# EAGLE design rxm (EAGLE 6.6.0)
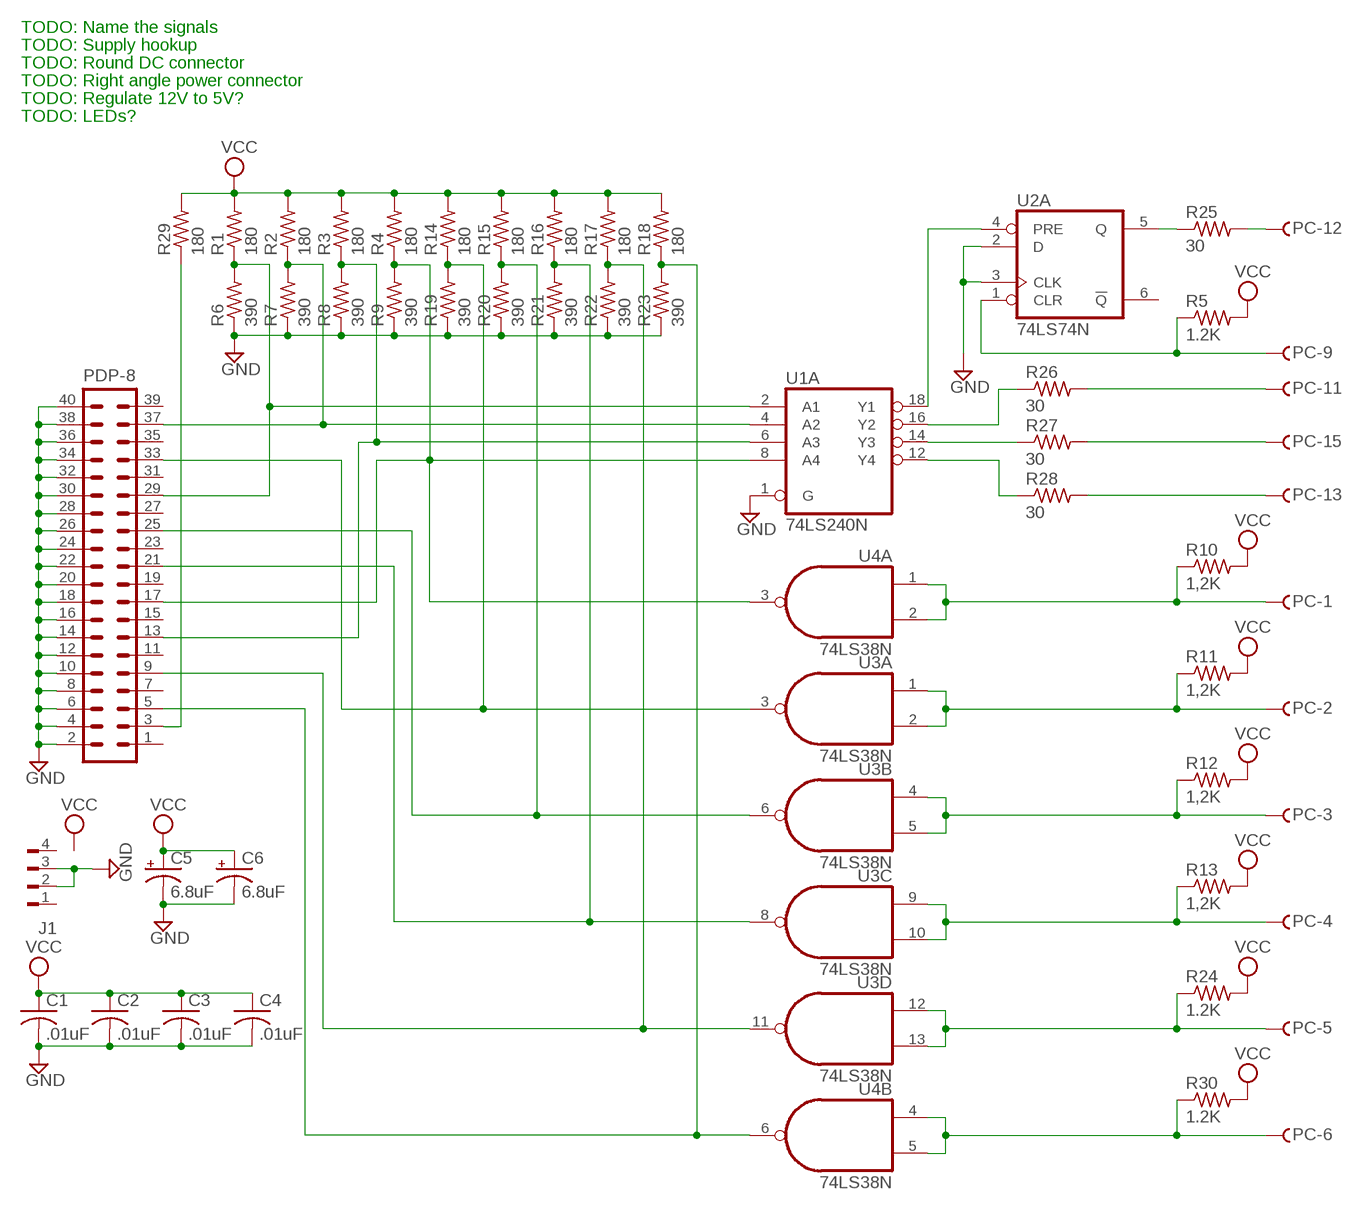
[diagram p0: schematic, sheet 1]

## Parts
C1  .01uF  C-US050-025X075  [C050-025X075]
C2  .01uF  C-US050-025X075  [C050-025X075]
C3  .01uF  C-US050-025X075  [C050-025X075]
C4  .01uF  C-US050-025X075  [C050-025X075]
C5  6.8uF  CPOL-USE2,5-6E  [E2,5-6E]
C6  6.8uF  CPOL-USE2,5-6E  [E2,5-6E]
J1  FLOPPY-4  [FLOPPY-4]
PC  F25HS  [F25H]
PDP-8  40H  [40H]
R1  180  R-US_0207/10  [0207/10]
R2  180  R-US_0207/10  [0207/10]
R3  180  R-US_0207/10  [0207/10]
R4  180  R-US_0207/10  [0207/10]
R5  1.2K  R-US_0207/10  [0207/10]
R6  390  R-US_0207/10  [0207/10]
R7  390  R-US_0207/10  [0207/10]
R8  390  R-US_0207/10  [0207/10]
R9  390  R-US_0207/10  [0207/10]
R10  1,2K  R-US_0207/10  [0207/10]
R11  1,2K  R-US_0207/10  [0207/10]
R12  1,2K  R-US_0207/10  [0207/10]
R13  1,2K  R-US_0207/10  [0207/10]
R14  180  R-US_0207/10  [0207/10]
R15  180  R-US_0207/10  [0207/10]
R16  180  R-US_0207/10  [0207/10]
R17  180  R-US_0207/10  [0207/10]
R18  180  R-US_0207/10  [0207/10]
R19  390  R-US_0207/10  [0207/10]
R20  390  R-US_0207/10  [0207/10]
R21  390  R-US_0207/10  [0207/10]
R22  390  R-US_0207/10  [0207/10]
R23  390  R-US_0207/10  [0207/10]
R24  1.2K  R-US_0207/10  [0207/10]
R25  30  R-US_0207/10  [0207/10]
R26  30  R-US_0207/10  [0207/10]
R27  30  R-US_0207/10  [0207/10]
R28  30  R-US_0207/10  [0207/10]
R29  180  R-US_0207/10  [0207/10]
R30  1.2K  R-US_0207/10  [0207/10]
U1  74LS240N  [DIL20]
U2  74LS74N  [DIL14]
U3  74LS38N  [DIL14]
U4  74LS38N  [DIL14]

## Nets
GND: C1.2 C2.2 C3.2 C4.2 C5.- C6.- J1.2 J1.3 PDP-8.2 PDP-8.4 PDP-8.6 PDP-8.8 PDP-8.10 PDP-8.12 PDP-8.14 PDP-8.16 PDP-8.18 PDP-8.20 PDP-8.22 PDP-8.24 PDP-8.26 PDP-8.28 PDP-8.30 PDP-8.32 PDP-8.34 PDP-8.36 PDP-8.38 PDP-8.40 R6.1 R7.1 R8.1 R9.1 R19.1 R20.1 R21.1 R22.1 R23.1 U1.1(A:G) U2.2(A:D) U2.3(A:CLK)
N$1: PDP-8.29 R1.1 R6.2 U1.2(A:A1)
N$2: PDP-8.37 R2.1 R7.2 U1.4(A:A2)
N$3: PDP-8.13 R3.1 R8.2 U1.6(A:A3)
N$4: PDP-8.17 R4.1 R9.2 U1.8(A:A4) U4.3(A:O)
N$6: PDP-8.33 R14.1 R19.2 U3.3(A:O)
N$7: PDP-8.25 R15.1 R20.2 U3.6(B:O)
N$8: PDP-8.21 R16.1 R21.2 U3.8(C:O)
N$9: PDP-8.9 R17.1 R22.2 U3.11(D:O)
N$10: PDP-8.5 R18.1 R23.2 U4.6(B:O)
N$11: PC.12 R25.2
N$12: PC.11 R26.2
N$13: PC.15 R27.2
N$14: PC.13 R28.2
N$15: PDP-8.3 R29.1
N$16: PC.1 R10.1 U4.1(A:I0) U4.2(A:I1)
N$17: PC.2 R11.1 U3.1(A:I0) U3.2(A:I1)
N$18: PC.3 R12.1 U3.4(B:I0) U3.5(B:I1)
N$19: PC.4 R13.1 U3.9(C:I0) U3.10(C:I1)
N$20: PC.6 R30.1 U4.4(B:I0) U4.5(B:I1)
N$21: PC.5 R24.1 U3.12(D:I0) U3.13(D:I1)
N$22: U1.18(A:Y1) U2.4(A:PRE)
N$23: PC.9 R5.1 U2.1(A:CLR)
N$24: R25.1 U2.5(A:Q)
N$25: R28.1 U1.12(A:Y4)
N$26: R27.1 U1.14(A:Y3)
N$27: R26.1 U1.16(A:Y2)
VCC: C1.1 C2.1 C3.1 C4.1 C5.+ C6.+ R1.2 R2.2 R3.2 R4.2 R5.2 R10.2 R11.2 R12.2 R13.2 R14.2 R15.2 R16.2 R17.2 R18.2 R24.2 R29.2 R30.2
Unconnected: J1.1 J1.4 PC.7 PC.8 PC.10 PC.14 PC.16 PC.17 PC.18 PC.19 PC.20 PC.21 PC.22 PC.23 PC.24 PC.25 PDP-8.1 PDP-8.7 PDP-8.11 PDP-8.15 PDP-8.19 PDP-8.23 PDP-8.27 PDP-8.31 PDP-8.35 PDP-8.39 U1.3(B:Y4) U1.5(B:Y3) U1.7(B:Y2) U1.9(B:Y1) U1.11(B:A1) U1.13(B:A2) U1.15(B:A3) U1.17(B:A4) U1.19(B:G) U2.6(A:!Q) U2.8(B:!Q) U2.9(B:Q) U2.10(B:PRE) U2.11(B:CLK) U2.12(B:D) U2.13(B:CLR) U4.8(C:O) U4.9(C:I0) U4.10(C:I1) U4.11(D:O) U4.12(D:I0) U4.13(D:I1)

## Notes on the sheet
- TODO: Name the signals
- TODO: Supply hookup
- TODO: Round DC connector
- TODO: Right angle power connector
- TODO: Regulate 12V to 5V?
- TODO: LEDs?

## Power pins joined to a net without a drawn wire
GND: U1.10(P:GND) U2.7(P:GND) U3.7(P:GND) U4.7(P:GND)
VCC: U1.20(P:VCC) U2.14(P:VCC) U3.14(P:VCC) U4.14(P:VCC)

## Library data of the parts
C1-C4 = rcl:C-US: CAPACITOR, American symbol
C5 C6 = rcl:CPOL-US: POLARIZED CAPACITOR, American symbol
J1 = con-amp:FLOPPY-4: MATE N-LOCK Floppy / HDD conector Distributor: Bürklin 71F970
PC = con-subd:F25?S: SUB-D; OC_FARNELL: unknown; OC_NEWARK: unknown
PDP-8 = con-harting-h:40H: CONNECTOR; OC_FARNELL: unknown; OC_NEWARK: unknown
R1-R30 = rcl:R-US_: RESISTOR, American symbol
U1 = 74xx-us:74*240: Octal BUFFER and LINE DRIVER, 3-state
U2 = 74xx-us:74*74: Dual D type positive edge triggered FLIP FLOP, preset and clear
U3 U4 = dec-con:74*38: Quad 2-input NAND gate, open collector output

## Board
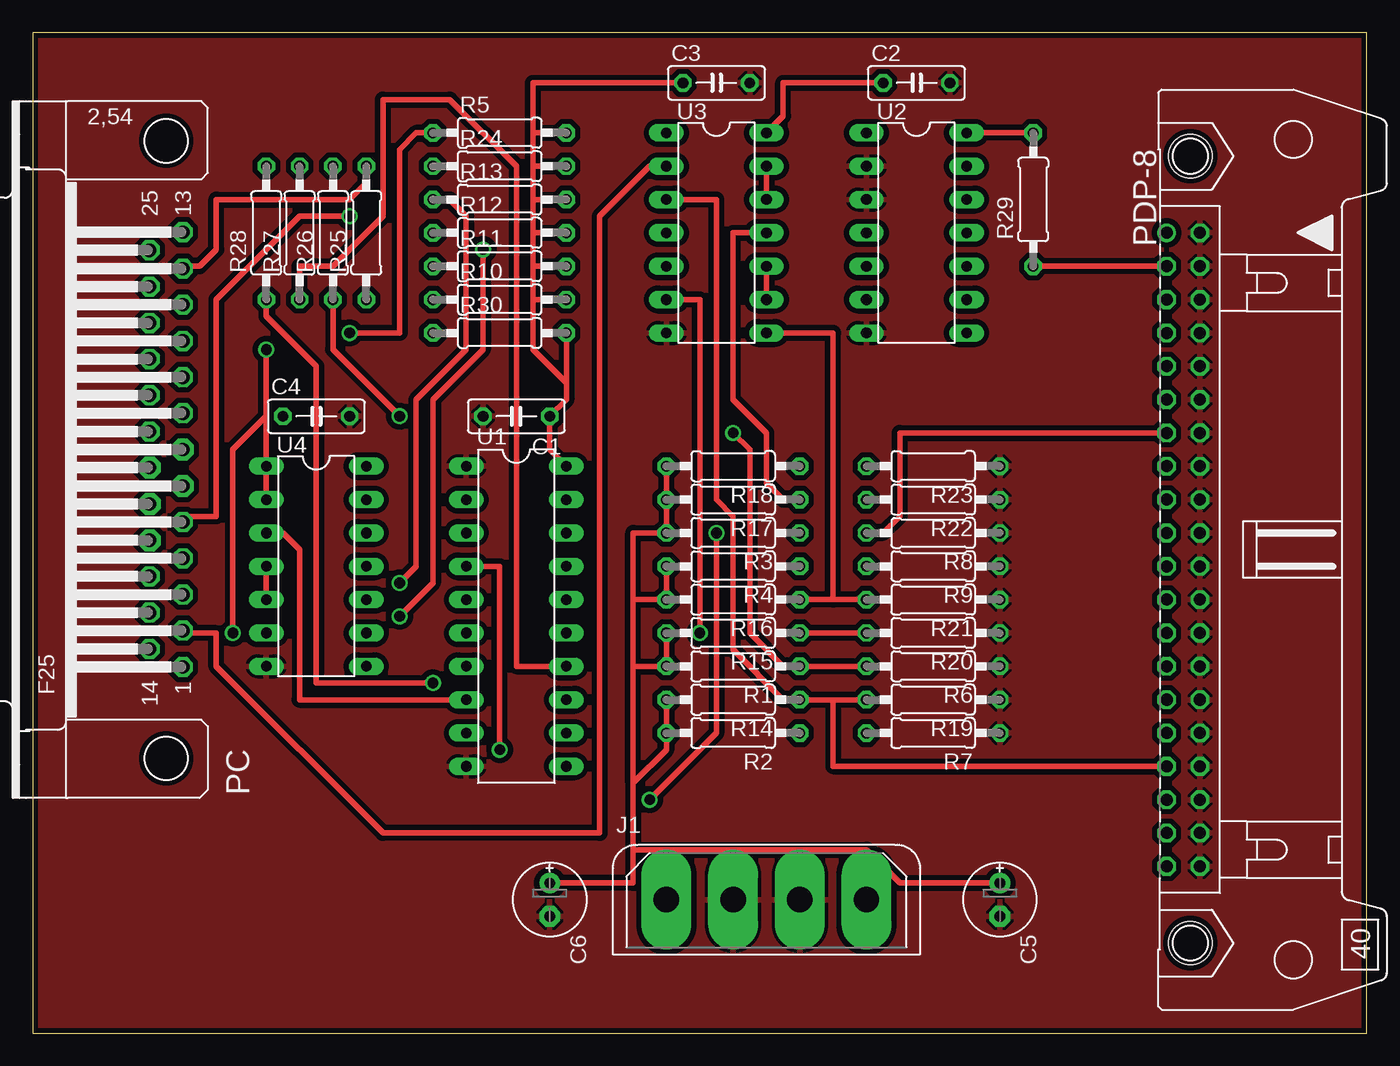
[diagram p1: board, top side]
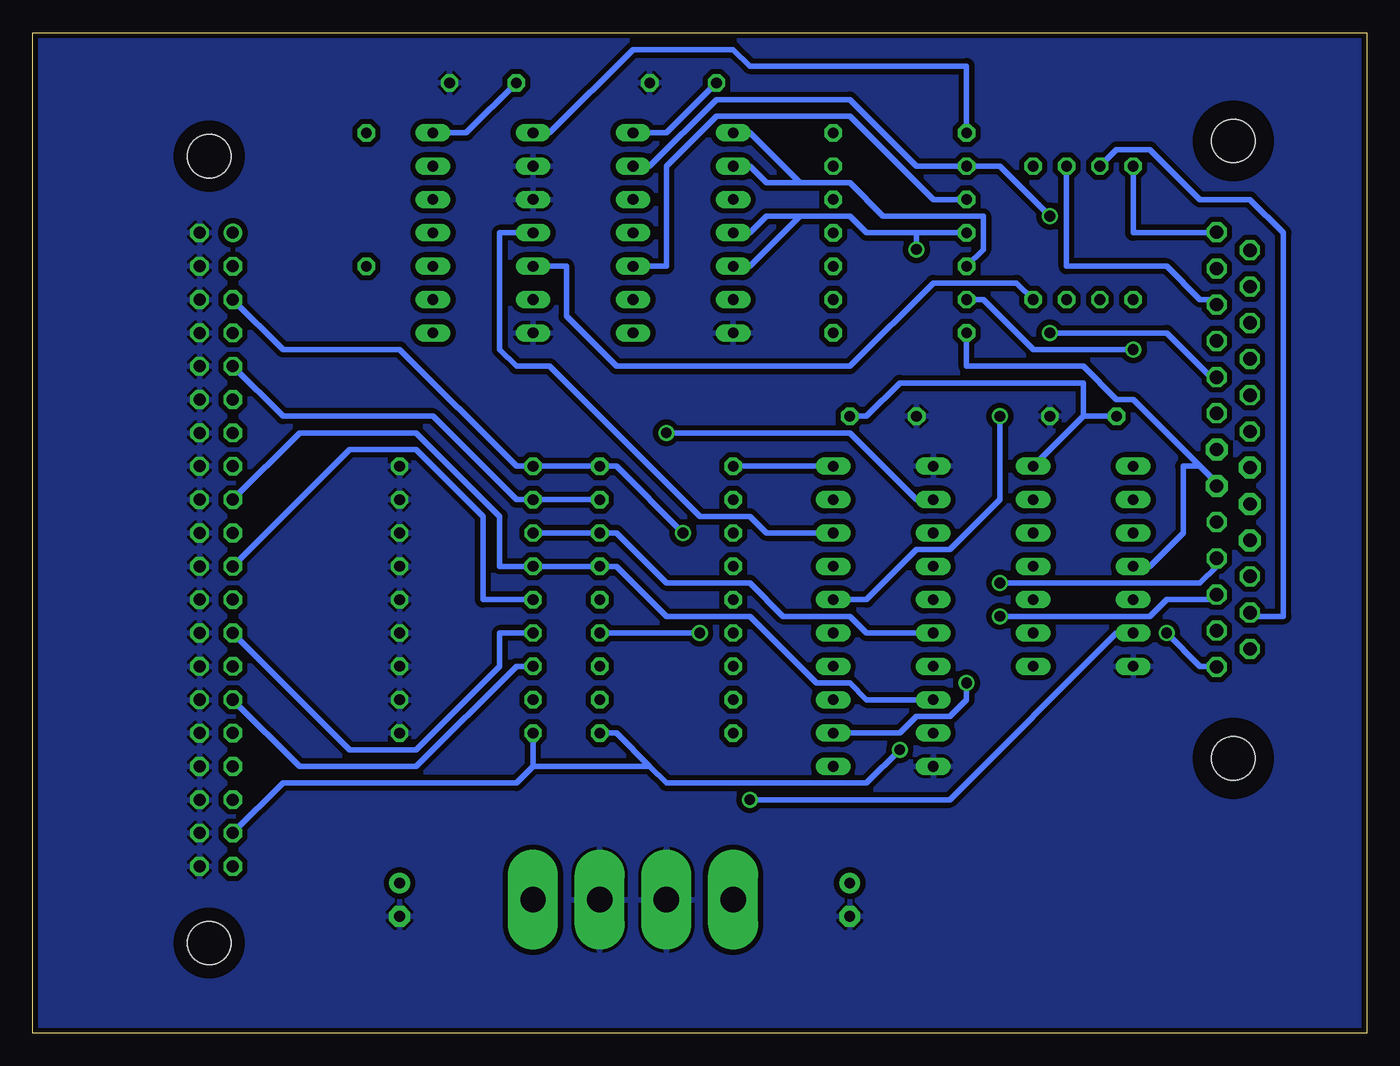
[diagram p2: board, bottom side, seen from below]

Size 101.6 x 76.2 mm. Coordinates in mm from the lower left corner, seen from the top.
Outline: 101.6,76.2 0,76.2 0,0 101.6,0 101.6,76.2
Copper layers (1+16): Top 0.035mm / dielectric 1.5mm / Bottom 0.035mm
Design rules "16mils": minimum track width 16mil, minimum drill 32mil, track to track 15mil, track to pad 10mil, pad to pad 10mil, via to via 10mil, smd to smd 10mil, copper to edge 13mil, drill to drill 10mil, minimum pad ring 10mil, minimum via ring 8mil, stop-mask expansion 0mil, vias tented up to drill 0mil, thermal gap 10mil

### Footprints (pad centres in the part's own frame; a part is rotated, then mirrored left to right if it is on the bottom)
C050-025X075 = drill 0.813 octagon: 1 -2.54,0; 2 2.54,0
E2,5-6E = drill 0.813 pad 1.575: + -1.27,0 | drill 0.813 pad 1.575 octagon: - 1.27,0
FLOPPY-4 = drill 1.93 pad 3.81 long: 1 7.62,0; 2 2.54,0; 3 -2.54,0; 4 -7.62,0
F25H = drill 1.016 octagon: 1 -16.561,-1.27; 2 -13.792,-1.27; 3 -11.049,-1.27; 4 -8.28,-1.27; 5 -5.512,-1.27; 8 2.769,-1.27; 9 5.512,-1.27; 10 8.28,-1.27; 11 11.049,-1.27; 12 13.792,-1.27; 13 16.561,-1.27; 14 -15.189,1.27; 15 -12.421,1.27; 16 -9.652,1.27; 20 1.372,1.27; 21 4.14,1.27; 22 6.909,1.27; 23 9.652,1.27; 24 12.421,1.27; 25 15.189,1.27 | drill 1.016 pad 1.67 octagon: 6 -2.769,-1.27; 7 0,-1.27; 17 -6.909,1.27; 18 -4.14,1.27; 19 -1.372,1.27 | hole 3.302: -23.52,0; 23.52,0
40H = drill 0.914: 1 -24.13,-1.27 | drill 0.914 octagon: 2 -24.13,1.27; 3 -21.59,-1.27; 4 -21.59,1.27; 5 -19.05,-1.27; 6 -19.05,1.27; 7 -16.51,-1.27; 8 -16.51,1.27; 9 -13.97,-1.27; 10 -13.97,1.27; 11 -11.43,-1.27; 12 -11.43,1.27; 13 -8.89,-1.27; 14 -8.89,1.27; 15 -6.35,-1.27; 16 -6.35,1.27; 17 -3.81,-1.27; 18 -3.81,1.27; 19 -1.27,-1.27; 20 -1.27,1.27; 21 1.27,-1.27; 22 1.27,1.27; 23 3.81,-1.27; 24 3.81,1.27; 25 6.35,-1.27; 26 6.35,1.27; 27 8.89,-1.27; 28 8.89,1.27; 29 11.43,-1.27; 30 11.43,1.27; 31 13.97,-1.27; 32 13.97,1.27; 33 16.51,-1.27; 34 16.51,1.27; 35 19.05,-1.27; 36 19.05,1.27; 37 21.59,-1.27; 38 21.59,1.27; 39 24.13,-1.27; 40 24.13,1.27 | hole 3.302: -29.972,0.533; 29.972,0.533
0207/10 = drill 0.813 octagon: 1 -5.08,0; 2 5.08,0
DIL20 = drill 0.813 long: 1 -11.43,-3.81; 2 -8.89,-3.81; 3 -6.35,-3.81; 4 -3.81,-3.81; 5 -1.27,-3.81; 6 1.27,-3.81; 7 3.81,-3.81; 8 6.35,-3.81; 9 8.89,-3.81; 10 11.43,-3.81; 11 11.43,3.81; 12 8.89,3.81; 13 6.35,3.81; 14 3.81,3.81; 15 1.27,3.81; 16 -1.27,3.81; 17 -3.81,3.81; 18 -6.35,3.81; 19 -8.89,3.81; 20 -11.43,3.81
DIL14 = drill 0.813 long: 1 -7.62,-3.81; 2 -5.08,-3.81; 3 -2.54,-3.81; 4 0,-3.81; 5 2.54,-3.81; 6 5.08,-3.81; 7 7.62,-3.81; 8 7.62,3.81; 9 5.08,3.81; 10 2.54,3.81; 11 0,3.81; 12 -2.54,3.81; 13 -5.08,3.81; 14 -7.62,3.81

### Placement (x,y rotation side)
C1  36.83,46.99 180 top
C2  67.31,72.39 0 top
C3  52.07,72.39 0 top
C4  21.59,46.99 0 top
C5  73.66,10.16 270 top
C6  39.37,10.16 270 top
J1  55.88,10.16 0 top
PC  10.16,44.45 90 top
PDP-8  87.63,36.83 270 top
R1  53.34,27.94 180 top
R2  53.34,22.86 180 top
R3  53.34,38.1 180 top
R4  53.34,35.56 180 top
R5  35.56,68.58 0 top
R6  68.58,27.94 180 top
R7  68.58,22.86 180 top
R8  68.58,38.1 180 top
R9  68.58,35.56 180 top
R10  35.56,55.88 0 top
R11  35.56,58.42 0 top
R12  35.56,60.96 0 top
R13  35.56,63.5 0 top
R14  53.34,25.4 180 top
R15  53.34,30.48 180 top
R16  53.34,33.02 180 top
R17  53.34,40.64 180 top
R18  53.34,43.18 180 top
R19  68.58,25.4 180 top
R20  68.58,30.48 180 top
R21  68.58,33.02 180 top
R22  68.58,40.64 180 top
R23  68.58,43.18 180 top
R24  35.56,66.04 0 top
R25  25.4,60.96 90 top
R26  22.86,60.96 90 top
R27  20.32,60.96 90 top
R28  17.78,60.96 90 top
R29  76.2,63.5 90 top
R30  35.56,53.34 0 top
U1  36.83,31.75 270 top
U2  67.31,60.96 270 top
U3  52.07,60.96 270 top
U4  21.59,35.56 270 top

### Tracks (layer width: path | path; a pad name or v marks a point on that pad's centre or on a via)
GND
  pour Bottom (isolate 0.406): 0,0 0,76.2 101.6,76.2 101.6,0
  pour Top (isolate 0.406): 0,0 0,76.2 101.6,76.2 101.6,0
N$1  (via drill 0.81)
  Top 0.406: R6.2 R1.1 57.15,27.94 54.61,30.48 54.61,44.45 v53.34,45.72
  Bottom 0.406: U1.2 34.29,40.64 39.37,45.72 v53.34,45.72 | PDP-8.29 81.28,20.32 72.39,20.32 64.77,27.94 R6.2
N$2  (via drill 0.81)
  Top 0.406: U1.4 35.56,35.56 v35.56,21.59
  Bottom 0.406: v35.56,21.59 38.1,19.05 53.34,19.05 54.61,20.32 | 54.61,20.32 57.15,22.86 R2.1 | 63.5,20.32 R7.2 | 54.61,20.32 63.5,20.32 | PDP-8.37 82.55,19.05 64.77,19.05 63.5,20.32
N$3
  Top 0.406: PDP-8.13 66.04,45.72 66.04,39.37 64.77,38.1 R8.2
  Bottom 0.406: U1.6 38.1,30.48 39.37,31.75 44.45,31.75 46.99,34.29 53.34,34.29 57.15,38.1 R3.1 R8.2
N$4
  Top 0.406: U1.8 20.32,25.4 20.32,36.83 19.05,38.1 U4.3
  Bottom 0.406: PDP-8.17 81.28,45.72 72.39,45.72 66.04,39.37 66.04,35.56 R9.2 R4.1 57.15,35.56 53.34,31.75 46.99,31.75 41.91,26.67 39.37,26.67 38.1,25.4 U1.8
N$6
  Top 0.406: R19.2 60.96,25.4 | 60.96,25.4 R14.1 57.15,25.4 53.34,29.21 53.34,39.37 52.07,40.64 52.07,63.5 U3.3 | PDP-8.33 60.96,20.32 60.96,25.4
N$7  (via drill 0.81)
  Top 0.406: R20.2 R15.1 | U3.6 50.8,55.88 v50.8,30.48
  Bottom 0.406: R15.1 v50.8,30.48 | PDP-8.25 77.47,21.59 72.39,21.59 66.04,27.94 66.04,30.48 R20.2
N$8
  Top 0.406: R21.2 60.96,33.02 | 60.96,33.02 R16.1 | U3.8 60.96,53.34 60.96,33.02
  Bottom 0.406: PDP-8.21 77.47,44.45 72.39,44.45 67.31,39.37 67.31,33.02 R21.2
N$9
  Top 0.406: U3.11 53.34,60.96 53.34,48.26 55.88,45.72 55.88,41.91 57.15,40.64 R17.1
  Bottom 0.406: R17.1 R22.2 64.77,40.64 71.12,46.99 82.55,46.99 PDP-8.9
N$10  (via drill 0.81)
  Top 0.406: v46.99,17.78 52.07,22.86 v52.07,38.1
  Bottom 0.406: U4.6 19.05,30.48 31.75,17.78 v46.99,17.78 | v52.07,38.1 57.15,43.18 R18.1 R23.2 64.77,43.18 73.66,52.07 82.55,52.07 PDP-8.5
N$11
  Top 0.406: R25.2 25.4,64.77 24.13,63.5 13.97,63.5 13.97,59.69 12.7,58.42 11.43,58.42 PC.12
N$12
  Bottom 0.406: R26.2 22.86,58.42 15.24,58.42 12.7,55.88 11.43,55.88 PC.11
N$13
  Bottom 0.406: R27.2 19.05,67.31 16.51,67.31 12.7,63.5 8.89,63.5 6.35,60.96 6.35,31.75 8.89,31.75 PC.15
N$14
  Bottom 0.406: R28.2 17.78,60.96 11.43,60.96 PC.13
N$15
  Top 0.406: PDP-8.3 R29.1
N$16  (via drill 0.81)
  Top 0.406: U4.2 U4.1 17.78,46.99 | 17.78,46.99 v17.78,52.07 | v15.24,30.48 15.24,44.45 17.78,46.99
  Bottom 0.406: R10.1 29.21,55.88 25.4,52.07 v17.78,52.07 | v15.24,30.48 12.7,27.94 11.43,27.94 PC.1
N$17
  Top 0.406: U3.2 46.99,66.04 43.18,62.23 43.18,15.24 26.67,15.24 13.97,27.94 13.97,30.48 11.43,30.48 PC.2
  Bottom 0.406: R11.1 29.21,59.69 29.21,62.23 36.83,62.23 39.37,64.77 43.18,64.77 | 43.18,64.77 45.72,64.77 46.99,66.04 U3.2 | U3.1 46.99,68.58 43.18,64.77
N$18  (via drill 0.81)
  Top 0.406: v27.94,31.75 30.48,34.29 30.48,48.26 34.29,52.07 v34.29,59.69
  Bottom 0.406: 34.29,60.96 38.1,60.96 39.37,62.23 43.18,62.23 | 34.29,60.96 R12.1 | 43.18,62.23 45.72,62.23 46.99,60.96 U3.4 | U3.5 46.99,58.42 43.18,62.23 | v27.94,31.75 16.51,31.75 15.24,33.02 11.43,33.02 PC.3 | 34.29,60.96 v34.29,59.69
N$19  (via drill 0.81)
  Top 0.406: U3.10 U3.9 | v27.94,34.29 29.21,35.56 29.21,48.26 33.02,52.07 33.02,62.23 31.75,63.5 R13.1
  Bottom 0.406: R13.1 33.02,63.5 39.37,69.85 49.53,69.85 53.34,66.04 53.34,58.42 U3.10 | v27.94,34.29 12.7,34.29 11.43,35.56 PC.4
N$20
  Top 0.406: U4.4 U4.5
  Bottom 0.406: R30.1 30.48,50.8 21.59,50.8 19.05,48.26 17.78,48.26 12.7,43.18 | 12.7,43.18 11.43,41.91 PC.6 | U4.4 16.51,35.56 13.97,38.1 13.97,43.18 12.7,43.18
N$21  (via drill 0.81)
  Top 0.406: U3.13 U3.12 | v24.13,62.23 20.32,62.23 13.97,55.88 13.97,39.37 11.43,39.37 PC.5
  Bottom 0.406: U3.13 54.61,66.04 49.53,71.12 39.37,71.12 34.29,66.04 R24.1 27.94,66.04 v24.13,62.23
N$22
  Bottom 0.406: U1.18 45.72,38.1 46.99,39.37 50.8,39.37 62.23,50.8 64.77,50.8 66.04,52.07 66.04,60.96 U2.4
N$23  (via drill 0.81)
  Top 0.406: v24.13,53.34 27.94,53.34 27.94,67.31 29.21,68.58 R5.1
  Bottom 0.406: R5.1 30.48,73.66 46.99,73.66 48.26,74.93 55.88,74.93 62.23,68.58 U2.1 | v24.13,53.34 15.24,53.34 11.43,49.53 PC.9
N$24
  Bottom 0.406: R25.1 26.67,57.15 33.02,57.15 39.37,50.8 57.15,50.8 60.96,54.61 60.96,58.42 U2.5
N$25  (via drill 0.81)
  Top 0.406: v30.48,26.67 21.59,26.67 21.59,50.8 17.78,54.61 R28.1
  Bottom 0.406: U1.12 35.56,22.86 34.29,24.13 31.75,24.13 30.48,25.4 v30.48,26.67
N$26
  Top 0.406: U1.14 36.83,27.94 36.83,66.04 31.75,71.12 26.67,71.12 26.67,62.23 22.86,58.42 20.32,58.42 R27.1
N$27  (via drill 0.81)
  Top 0.406: v27.94,46.99 22.86,52.07 R26.1
  Bottom 0.406: U1.16 38.1,33.02 34.29,36.83 31.75,36.83 27.94,40.64 v27.94,46.99
VCC
  Top 0.406: R18.2 R17.2 R3.2 45.72,38.1 45.72,33.02 | R4.2 R16.2 45.72,33.02 | R15.2 R1.2 45.72,27.94 | R14.2 R2.2 48.26,21.59 45.72,19.05 | C6.+ 45.72,11.43 45.72,13.97 | 45.72,19.05 45.72,13.97 | C5.+ 66.04,11.43 63.5,13.97 45.72,13.97 | 45.72,19.05 45.72,27.94 | 45.72,27.94 45.72,33.02 | R29.2 U2.14 | R30.2 40.64,49.53 | 40.64,49.53 40.64,48.26 C1.1 39.37,44.45 U1.20 | 38.1,55.88 R10.2 | 38.1,55.88 38.1,52.07 40.64,49.53 | 38.1,58.42 R11.2 | 38.1,55.88 38.1,58.42 | 38.1,60.96 R12.2 | 38.1,58.42 38.1,60.96 | 38.1,63.5 R13.2 | 38.1,60.96 38.1,63.5 | 38.1,66.04 R24.2 | 38.1,63.5 38.1,66.04 | 38.1,68.58 R5.2 | 38.1,66.04 38.1,68.58 | C3.1 38.1,72.39 38.1,68.58 | C2.1 57.15,72.39 57.15,69.85 U3.14
  Bottom 0.406: C2.1 68.58,68.58 U2.14 | C3.1 53.34,68.58 U3.14 | 21.59,46.99 U4.14 | C4.1 21.59,46.99 | 21.59,46.99 21.59,49.53 35.56,49.53 38.1,46.99 C1.1 | U1.20 R18.2